# Altium schematic sheet DPAD.SchDoc
size A4; SheetNumber: 1; SheetTotal: 1
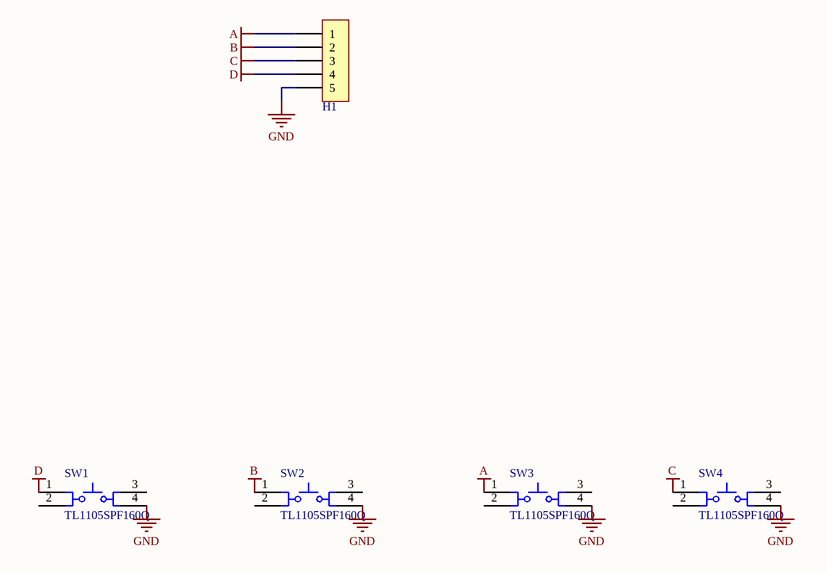
[diagram p0: DPAD.SchDoc]

## Parts
H1  HDR,2.54mm,1x5  [HEADER_2.54MM_1x5PIN]  (value not drawn)  (no BOM)
SW1  TL1105SPF160Q  [ESWI-TL1105SPF_V]
SW2  TL1105SPF160Q  [ESWI-TL1105SPF_V]
SW3  TL1105SPF160Q  [ESWI-TL1105SPF_V]
SW4  TL1105SPF160Q  [ESWI-TL1105SPF_V]

## Nets
A: H1.1 SW3.1
B: H1.2 SW2.1
C: H1.3 SW4.1
D: H1.4 SW1.1
GND: H1.5 SW1.4 SW2.4 SW3.4 SW4.4

Not connected (* = marked no-connect by the designer): SW1 2 3; SW2 2 3; SW3 2 3; SW4 2 3

## Library data of the parts
H1 = HDR,2.54mm,1x5: Connector - 2.54mm, 1x5-pin
SW1-SW4 = CMP-2000-07248-1: Tact Switch, SPST-NO, 50 mA, 12 VDC, -20 to 70 degC, 4-Pin THD, RoHS, Bulk; Manufacturer: E-Switch; Actuation Force: 1.6N; Actuator Style: RoundButton; Package URL: http://spec_sheets.e-switch.com/specs/P010201.pdf; Contact Material: Silver; Size: 6x6mm; Manufacturer URL: http://www.e-switch.ch/en/; Datasheet Version: 12/2013; Package Description: 4-Pin Through Hole Device, Body 6 x 6 mm; Datasheet URL: https://www.e-switch.com/system/asset/product_line/data_sheet/140/TL1105.pdf; Termination Style: RightAngle; Package Reference: TL1105SPF; Mounting Technology: ThroughHole